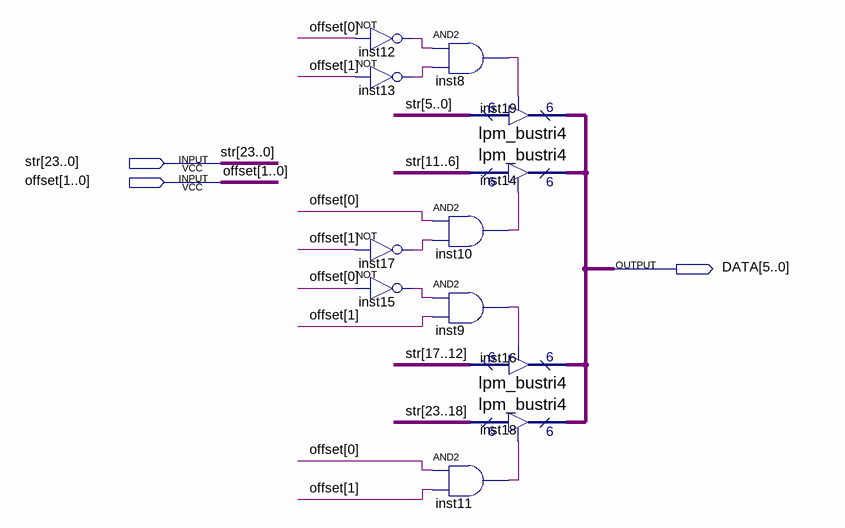
[diagram p0: schematic sheet]
// Quartus schematic pars_str.bdf as structural Verilog: 12 symbols, 3 pins
module pars_str (
  input  [23:0] str,
  input  [1:0] offset,
  output [5:0] DATA
);

  wire inst8_out, inst9_out, inst10_out, inst11_out, inst12_out, inst13_out, inst15_out, inst17_out;

  not inst12 (inst12_out, offset[0]);
  not inst13 (inst13_out, offset[1]);
  not inst17 (inst17_out, offset[1]);
  not inst15 (inst15_out, offset[0]);
  and inst8 (inst8_out, inst12_out, inst13_out);
  and inst10 (inst10_out, offset[0], inst17_out);
  and inst9 (inst9_out, inst15_out, offset[1]);
  and inst11 (inst11_out, offset[0], offset[1]);
  lpm_bustri4 inst19 (.enabledt(inst8_out), .data(str[5:0]), .tridata(DATA));
  lpm_bustri4 inst14 (.enabledt(inst10_out), .data(str[11:6]), .tridata(DATA));
  lpm_bustri4 inst16 (.enabledt(inst9_out), .data(str[17:12]), .tridata(DATA));
  lpm_bustri4 inst18 (.enabledt(inst11_out), .data(str[23:18]), .tridata(DATA));
endmodule
